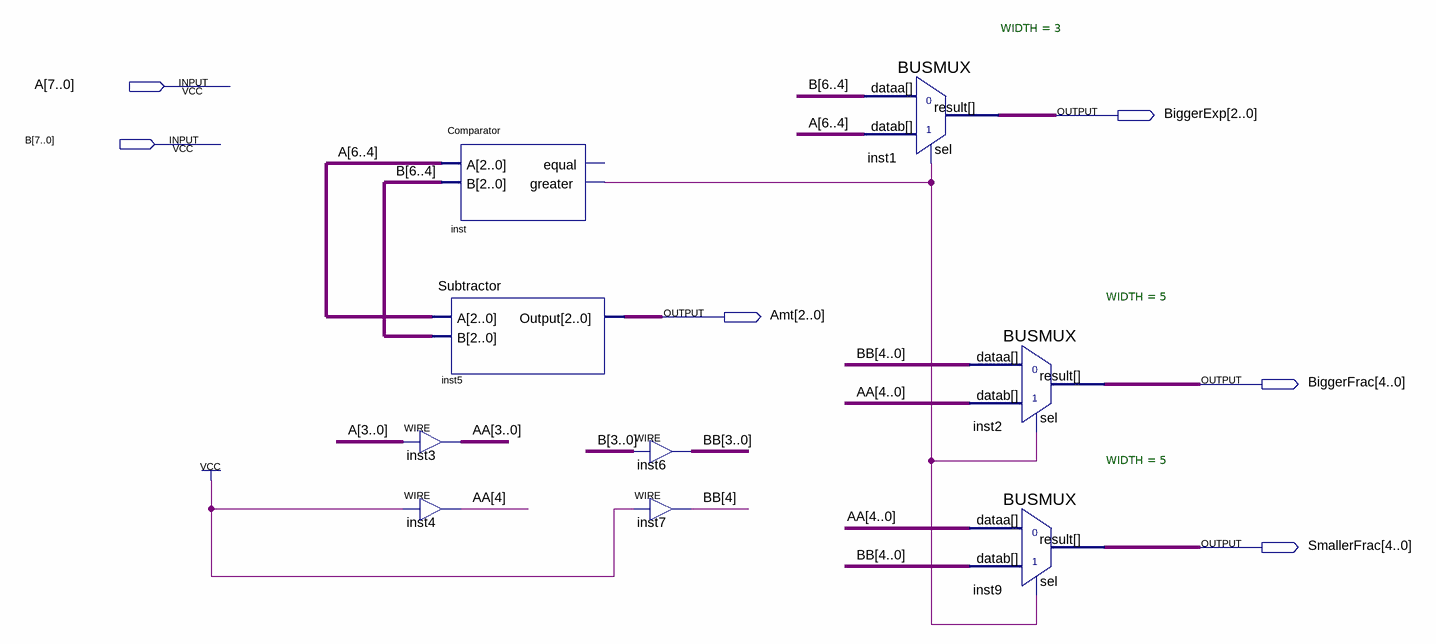
[diagram p0: schematic sheet]
// Quartus schematic InputCreator.bdf as structural Verilog: 9 symbols, 6 pins
module InputCreator (
  input  [7:0] A,
  input  [7:0] B,
  output [2:0] BiggerExp,
  output [2:0] Amt,
  output [4:0] BiggerFrac,
  output [4:0] SmallerFrac
);

  wire inst_greater;
  wire [4:0] AA, BB;

  Subtractor inst5 (.A(A[6:4]), .B(B[6:4]), .Output(Amt));
  assign AA[3:0] = A[3:0];  // WIRE inst3
  assign AA[4] = 1'b1;  // WIRE inst4
  Comparator inst (.A(A[6:4]), .B(B[6:4]), .greater(inst_greater));  // open: equal
  assign BB[3:0] = B[3:0];  // WIRE inst6
  assign BB[4] = 1'b1;  // WIRE inst7
  BUSMUX #(.WIDTH(3)) inst1 (.datab(A[6:4]), .sel(inst_greater), .dataa(B[6:4]), .result(BiggerExp));
  BUSMUX #(.WIDTH(5)) inst2 (.datab(AA), .sel(inst_greater), .dataa(BB), .result(BiggerFrac));
  BUSMUX #(.WIDTH(5)) inst9 (.datab(BB), .sel(inst_greater), .dataa(AA), .result(SmallerFrac));
endmodule
